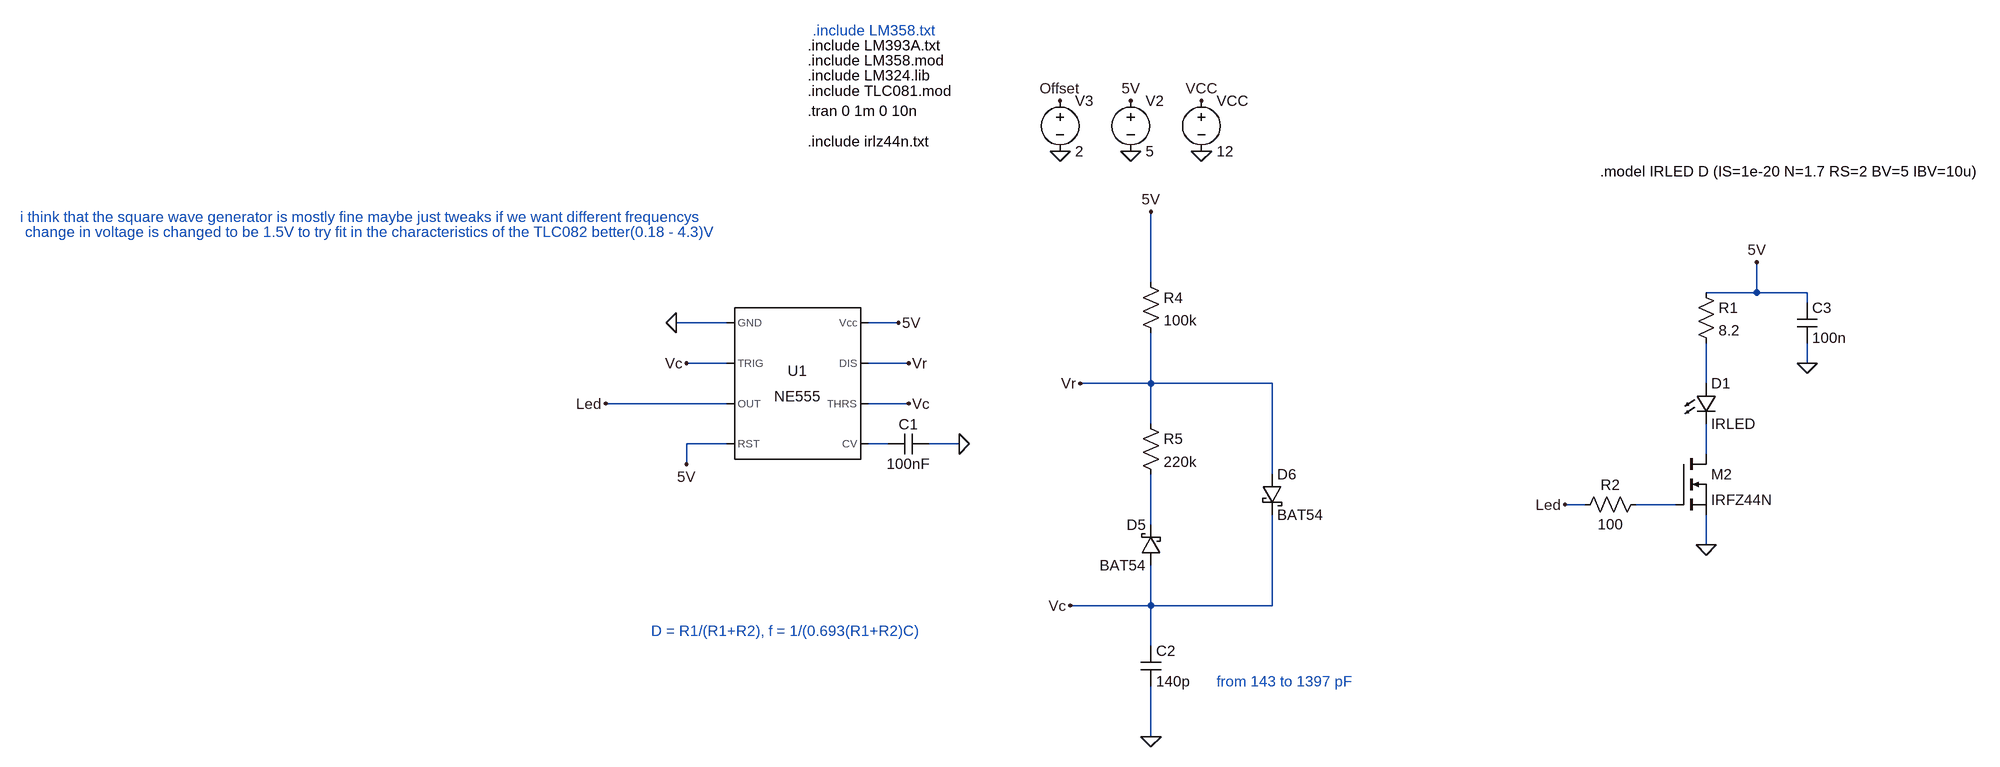
[diagram p0: schematic 555 timer implementations.asc]
555 timer implementations.asc, the LTspice schematic file:
Version 4.1
SHEET 1 2024 1284
WIRE -592 48 -592 -64
WIRE 368 64 368 16
WIRE 368 64 288 64
WIRE 448 64 368 64
WIRE 448 80 448 64
WIRE -1264 112 -1344 112
WIRE -992 112 -1040 112
WIRE -1264 176 -1328 176
WIRE -976 176 -1040 176
WIRE 448 176 448 144
WIRE -592 208 -592 128
WIRE -592 208 -704 208
WIRE -400 208 -592 208
WIRE 288 208 288 144
WIRE -1264 240 -1456 240
WIRE -976 240 -1040 240
WIRE -592 272 -592 208
WIRE -1264 304 -1328 304
WIRE -1008 304 -1040 304
WIRE -896 304 -944 304
WIRE 288 320 288 272
WIRE -1328 336 -1328 304
WIRE -400 352 -400 208
WIRE 96 400 64 400
WIRE 240 400 176 400
WIRE -592 432 -592 352
WIRE 288 464 288 416
WIRE -592 560 -592 496
WIRE -592 560 -720 560
WIRE -400 560 -400 416
WIRE -400 560 -592 560
WIRE -592 624 -592 560
WIRE -592 768 -592 688
FLAG -624 -240 5V
FLAG -736 -240 Offset
FLAG -624 -160 0
FLAG -736 -160 0
FLAG -512 -160 0
FLAG -512 -240 VCC
FLAG -592 -64 5V
FLAG -592 768 0
FLAG -992 112 5V
FLAG -720 560 Vc
FLAG -1328 176 Vc
FLAG -976 240 Vc
FLAG -704 208 Vr
FLAG -976 176 Vr
FLAG -1456 240 Led
FLAG -1344 112 0
FLAG -896 304 0
FLAG 368 16 5V
FLAG 288 464 0
FLAG 448 176 0
FLAG 64 400 Led
FLAG -1328 336 5V
SYMBOL voltage -512 -256 R0
WINDOW 123 0 0 Left 0
WINDOW 39 0 0 Left 0
SYMATTR InstName VCC
SYMATTR Value 12
SYMBOL voltage -624 -256 R0
WINDOW 123 0 0 Left 0
WINDOW 39 0 0 Left 0
SYMATTR InstName V2
SYMATTR Value 5
SYMBOL voltage -736 -256 R0
WINDOW 123 0 0 Left 0
WINDOW 39 0 0 Left 0
SYMATTR InstName V3
SYMATTR Value 2
SYMBOL Res -608 32 R0
SYMATTR InstName R4
SYMATTR Value 100k
SYMBOL Res -608 256 R0
SYMATTR InstName R5
SYMATTR Value 220k
SYMBOL schottky -576 496 R180
WINDOW 0 24 64 Left 2
WINDOW 3 24 0 Left 2
SYMATTR InstName D5
SYMATTR Value BAT54
SYMATTR Description Zener Diode
SYMATTR Type zener
SYMBOL Cap -608 624 R0
SYMATTR InstName C2
SYMATTR Value 140p
SYMBOL schottky -416 352 R0
SYMATTR InstName D6
SYMATTR Value BAT54
SYMATTR Description Zener Diode
SYMATTR Type zener
SYMBOL Misc/NE555 -1152 208 R0
SYMATTR InstName U1
SYMBOL Cap -944 288 R90
WINDOW 0 0 32 VBottom 2
WINDOW 3 32 32 VTop 2
SYMATTR InstName C1
SYMATTR Value 100nF
SYMBOL nmos 240 320 R0
SYMATTR InstName M2
SYMATTR Value IRFZ44N
SYMBOL LED 272 208 R0
SYMATTR InstName D1
SYMATTR Value IRLED
SYMBOL res 272 48 R0
SYMATTR InstName R1
SYMATTR Value 8.2
SYMBOL cap 432 80 R0
SYMATTR InstName C3
SYMATTR Value 100n
SYMBOL res 192 384 R90
WINDOW 0 0 56 VBottom 2
WINDOW 3 32 56 VTop 2
SYMATTR InstName R2
SYMATTR Value 100
TEXT -1136 -224 Left 2 !.tran 0 1m 0 10n
TEXT -1136 -256 Left 2 !.include TLC081.mod
TEXT -1136 -280 Left 2 !.include LM324.lib
TEXT -1136 -304 Left 2 !.include LM358.mod
TEXT -1136 -328 Left 2 !.include LM393A.txt
TEXT -1128 -352 Left 2 ;.include LM358.txt
TEXT -2384 -56 Left 2 ;i think that the square wave generator is mostly fine maybe just tweaks if we want different frequencys
TEXT -2376 -32 Left 2 ;change in voltage is changed to be 1.5V to try fit in the characteristics of the TLC082 better(0.18 - 4.3)V
TEXT -1136 -176 Left 2 !.include irlz44n.txt
TEXT -488 680 Left 2 ;from 143 to 1397 pF
TEXT -1384 600 Left 2 ;D = R1/(R1+R2), f = 1/(0.693(R1+R2)C)
TEXT 120 -128 Left 2 !.model IRLED D (IS=1e-20 N=1.7 RS=2 BV=5 IBV=10u)

The netlist it stands for:
* 555 timer implementations.asc
VCC VCC 0 12
V2 5V 0 5
V3 Offset 0 2
R4 5V Vr 100k
R5 Vr N005 220k
D5 Vc N005 BAT54
C2 Vc 0 140p
D6 Vr Vc BAT54
X§U1 0 Vc Led 5V N002 Vc Vr 5V NE555  ; pins GND TRIG OUT RST CV THRS DIS Vcc
C1 0 N002 100nF
M2 N003 N004 0 0 IRFZ44N
D1 N001 N003 IRLED
R1 5V N001 8.2
C3 5V 0 100n
R2 N004 Led 100
.model D D
.lib standard.dio
.model NMOS NMOS
.model PMOS PMOS
.lib standard.mos
.tran 0 1m 0 10n
.include TLC081.mod
.include LM324.lib
.include LM358.mod
.include LM393A.txt
* .include LM358.txt
* i think that the square wave generator is mostly fine maybe just tweaks if we want different frequencys
* change in voltage is changed to be 1.5V to try fit in the characteristics of the TLC082 better(0.18 - 4.3)V
.include irlz44n.txt
* from 143 to 1397 pF
* D = R1/(R1+R2), f = 1/(0.693(R1+R2)C)
.model IRLED D (IS=1e-20 N=1.7 RS=2 BV=5 IBV=10u)
.lib NE555.sub
.backanno
.end